# EAGLE design CAN-BUS Shield  v1.2 (EAGLE 6.0)
DESCRIPTION: microOBD 200 OBD-II Module; HW_REV: 1.4; PCB_REV: C; PCB_SPEC1: Layer Count: 4; PCB_SPEC2: Size: 1.3" x 0.59"; PCB_SPEC3: Finish Thickness: 0.049" - 0.052"; PCB_SPEC4: Copper Weight: 1oz; TITLE: STM1120
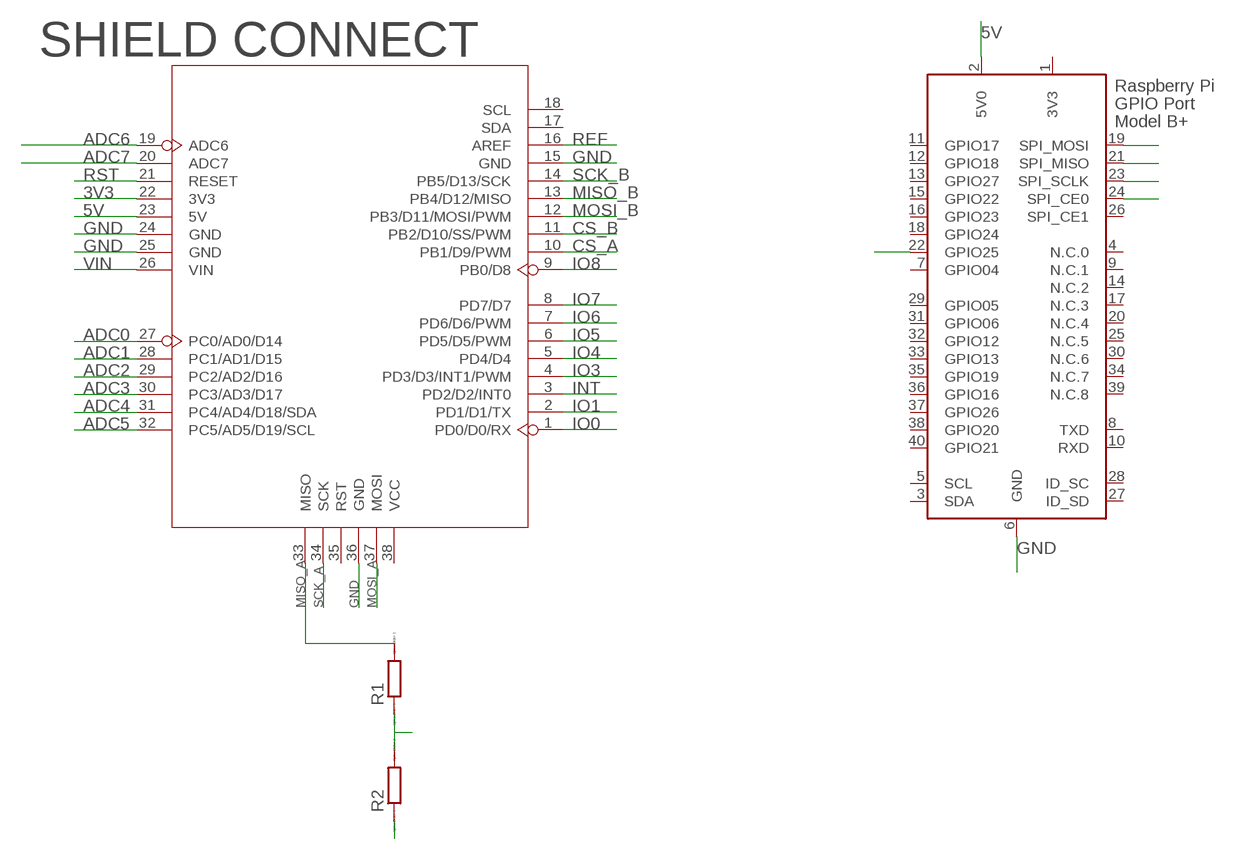
[diagram p0: schematic, sheet 1]

## Parts
R1  R0207/10  [0207/10]
R2  R0207/10  [0207/10]
U3  ARDUINO-38P'WITH/-SILK'  [ARDUINO-38P-WITH/-SILK-500519002]
X2  RASPI_BOARD_B+_E0  [RASPI_BOARD_B+_EDGES_0DRILL]

## Nets
3V3: U3.22(3V3)
5V: U3.23(5V) X2.2(5V0)
ADC0: U3.27(PC0/AD0/D14)
ADC1: U3.28(PC1/AD1/D15)
ADC2: U3.29(PC2/AD2/D16)
ADC3: U3.30(PC3/AD3/D17)
ADC4: U3.31(PC4/AD4/D18/SDA)
ADC5: U3.32(PC5/AD5/D19/SCL)
ADC6: U3.19(ADC6)
ADC7: U3.20(ADC7)
CS_A: U3.10(PB1/D9/PWM)
CS_B: U3.11(PB2/D10/SS/PWM) X2.24(SPI_CE0)
GND: R2.1 U3.15(GND) U3.24(GND) U3.25(GND) U3.36(GND) X2.6(GND)
INT: U3.3(PD2/D2/INT0) X2.22(GPIO25)
IO0: U3.1(PD0/D0/RX)
IO1: U3.2(PD1/D1/TX)
IO3: U3.4(PD3/D3/INT1/PWM)
IO4: U3.5(PD4/D4)
IO5: U3.6(PD5/D5/PWM)
IO6: U3.7(PD6/D6/PWM)
IO7: U3.8(PD7/D7)
IO8: U3.9(PB0/D8)
MISO_A: R1.2 U3.33(MISO)
MISO_B: U3.13(PB4/D12/MISO)
MISO_SCLD: R1.1 R2.2 X2.21(SPI_MISO)
MOSI_A: U3.37(MOSI) X2.19(SPI_MOSI)
MOSI_B: U3.12(PB3/D11/MOSI/PWM)
REF: U3.16(AREF)
RST: U3.21(RESET)
SCK_A: U3.34(SCK) X2.23(SPI_SCLK)
SCK_B: U3.14(PB5/D13/SCK)
VIN: U3.26(VIN)
Unconnected: U3.17(SDA) U3.18(SCL) U3.35(RST) U3.38(VCC) X2.3(SDA) X2.4(N.C.0) X2.5(SCL) X2.7(GPIO04) X2.8(TXD) X2.9(N.C.1) X2.10(RXD) X2.11(GPIO17) X2.12(GPIO18) X2.13(GPIO27) X2.14(N.C.2) X2.15(GPIO22) X2.16(GPIO23) X2.17(N.C.3) X2.18(GPIO24) X2.20(N.C.4) X2.25(N.C.5) X2.26(SPI_CE1) X2.27(ID_SD) X2.28(ID_SC) X2.29(GPIO05) X2.30(N.C.6) X2.31(GPIO06) X2.32(GPIO12) X2.33(GPIO13) X2.34(N.C.7) X2.35(GPIO19) X2.36(GPIO16) X2.37(GPIO26) X2.38(GPIO20) X2.39(N.C.8) X2.40(GPIO21)

## Notes on the sheet
- SHIELD CONNECT

## Power pins joined to a net without a drawn wire
3V3: X2.1(3V3)

## Library data of the parts
R1 R2 = eagle-ltspice:R: RESISTOR, European symbol; SPICEMODEL: NONE; SPICEPREFIX: R
U3 = moudle:ARDUINO-38P
X2 = raspberrypi_bastelstube_v13:RASPI_BOARD_B+: Raspberry Pi GPIO connector with markings for the outer dimensions of the Raspberry Pi board model B+ with different sets of drill holes or mounting pads

## Net classes
0 default: width 0.152 mm, drill 0.305 mm, clearance 0.152 mm

## Board
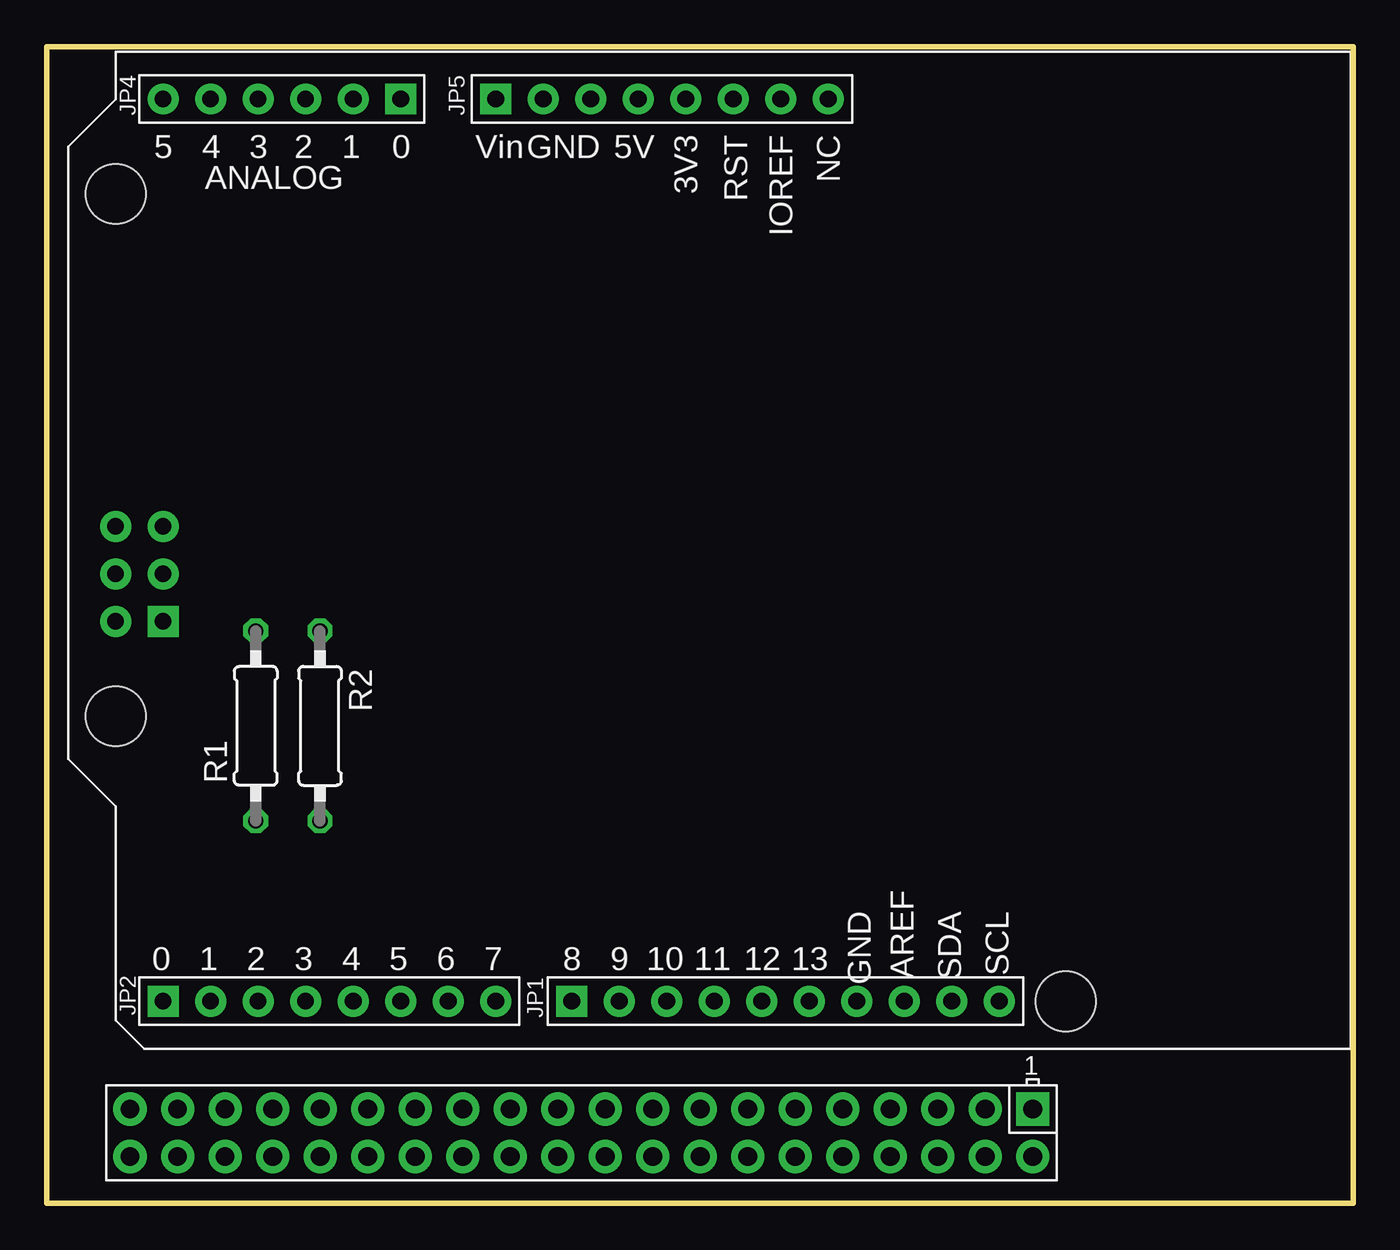
[diagram p1: board, top side]
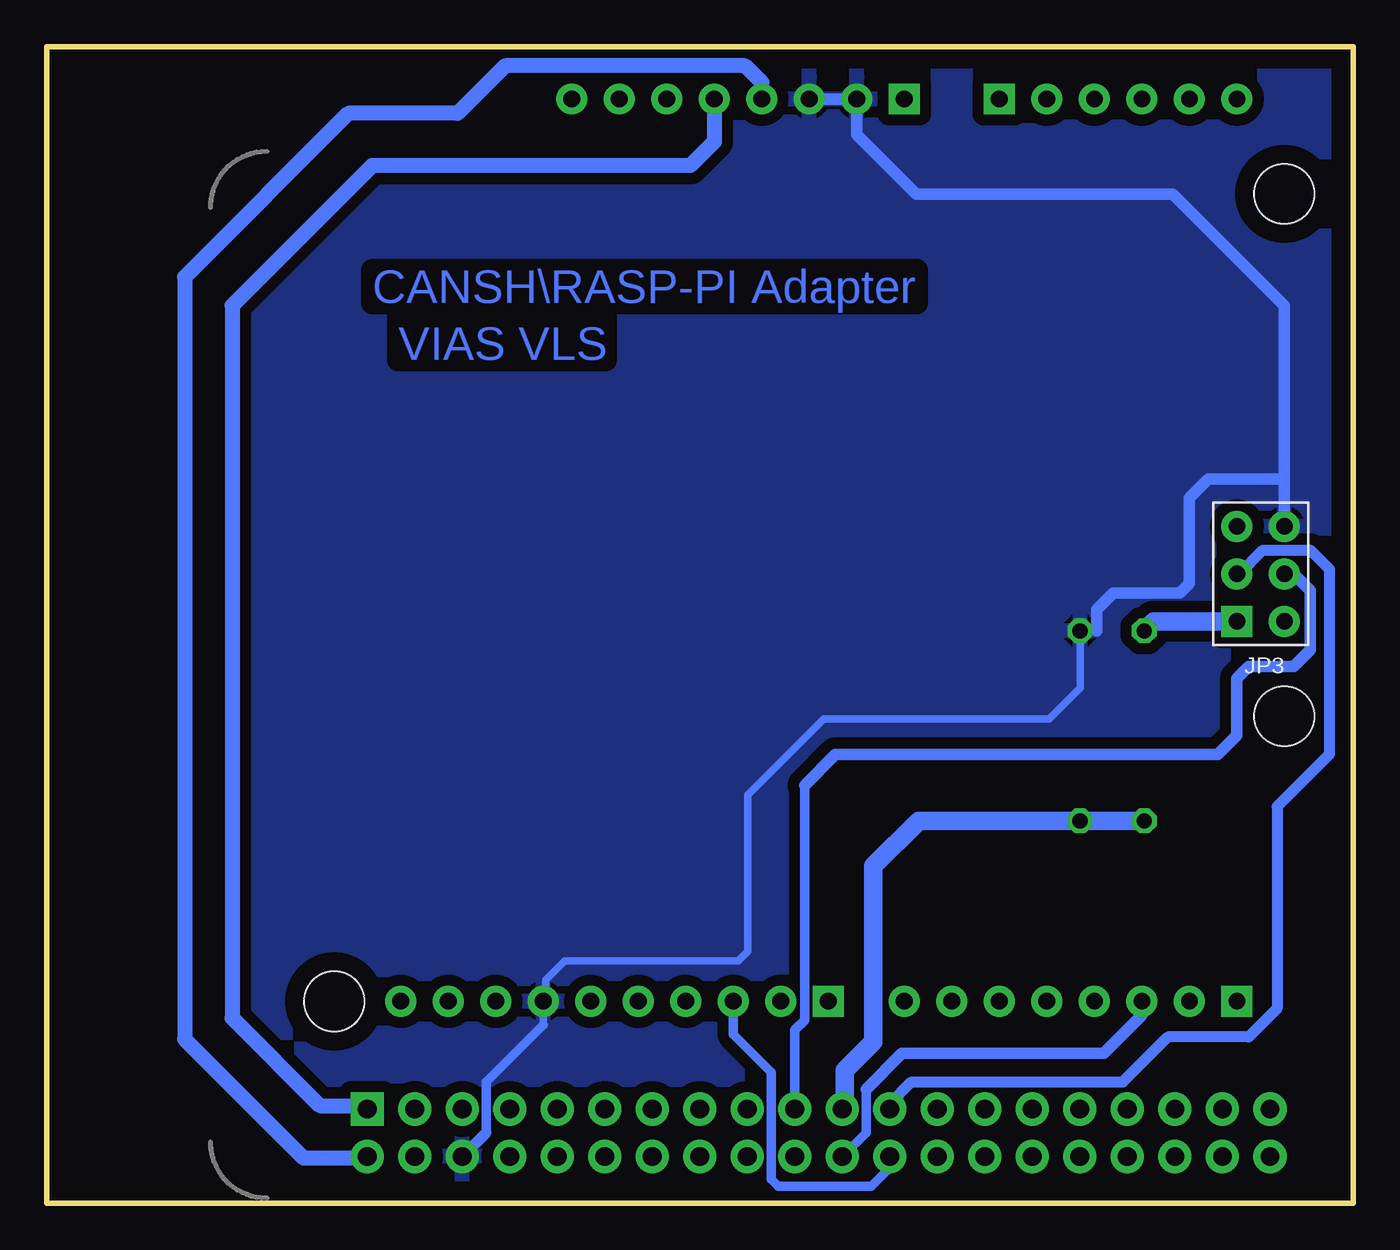
[diagram p2: board, bottom side, seen from below]

Size 69.85 x 61.85 mm. Coordinates in mm from the lower left corner, seen from the top.
Outline: 69.85,61.85 0,61.85 0,0 69.85,0 69.85,61.85
Copper layers (1*16): Top 0.035mm / dielectric 1.5mm / Bottom 0.035mm
Design rules: minimum track width 18mil, minimum drill 24mil, track to track 20mil, track to pad 20mil, pad to pad 8mil, via to via 8mil, smd to smd 8mil, copper to edge 40mil, drill to drill 8mil, minimum pad ring 10mil, minimum via ring 8mil, stop-mask expansion 4mil, vias tented up to drill 0mil, thermal gap 10mil

### Footprints (pad centres in the part's own frame; a part is rotated, then mirrored left to right if it is on the bottom)
0207/10 = drill 0.813 octagon: 1 -5.08,0; 2 5.08,0
ARDUINO-38P-WITH/-SILK-500519002 = drill 0.889 pad 1.651 square: 1 63.5,50.8; 9 41.656,50.8; 26 45.72,2.54; 27 50.8,2.54; 33 63.5,30.48 | drill 0.889 pad 1.651: 2 60.96,50.8; 3 58.42,50.8; 4 55.88,50.8; 5 53.34,50.8; 6 50.8,50.8; 7 48.26,50.8; 8 45.72,50.8; 10 39.116,50.8; 11 36.576,50.8; 12 34.036,50.8; 13 31.496,50.8; 14 28.956,50.8; 15 26.416,50.8; 16 23.876,50.8; 17 21.336,50.8; 18 18.796,50.8; 19 27.94,2.54; 20 30.48,2.54; 21 33.02,2.54; 22 35.56,2.54; 23 38.1,2.54; 24 40.64,2.54; 25 43.18,2.54; 28 53.34,2.54; 29 55.88,2.54; 30 58.42,2.54; 31 60.96,2.54; 32 63.5,2.54; 34 63.5,27.94; 35 63.5,25.4; 36 66.04,25.4; 37 66.04,27.94; 38 66.04,30.48 | hole 3.2: 15.24,50.8; 66.04,35.56; 66.04,7.62
RASPI_BOARD_B+_EDGES_0DRILL = drill 1 pad 1.778 square: 1 8.37,51.23 | drill 1 pad 1.778: 2 8.37,53.77; 3 10.91,51.23; 4 10.91,53.77; 5 13.45,51.23; 6 13.45,53.77; 7 15.99,51.23; 8 15.99,53.77; 9 18.53,51.23; 10 18.53,53.77; 11 21.07,51.23; 12 21.07,53.77; 13 23.61,51.23; 14 23.61,53.77; 15 26.15,51.23; 16 26.15,53.77; 17 28.69,51.23; 18 28.69,53.77; 19 31.23,51.23; 20 31.23,53.77; 21 33.77,51.23; 22 33.77,53.77; 23 36.31,51.23; 24 36.31,53.77; 25 38.85,51.23; 26 38.85,53.77; 27 41.39,51.23; 28 41.39,53.77; 29 43.93,51.23; 30 43.93,53.77; 31 46.47,51.23; 32 46.47,53.77; 33 49.01,51.23; 34 49.01,53.77; 35 51.55,51.23; 36 51.55,53.77; 37 54.09,51.23; 38 54.09,53.77; 39 56.63,51.23; 40 56.63,53.77

### Placement (x,y rotation side)
R1  11.18,25.53 90 top
R2  14.61,25.53 270 top
U3  69.72,61.59 180 top
X2  61.09,56.26 180 top

### Tracks (layer width: path | path; a pad name or v marks a point on that pad's centre or on a via)
3V3
  Bottom 0.813: U3.22 34.16,56.77 35.43,55.5 52.45,55.5 59.94,48.01 59.94,9.91 55.24,5.21 52.89,5.21 X2.1
5V
  Bottom 0.813: U3.23 31.62,59.94 32.51,60.83 45.34,60.83 47.88,58.29 53.72,58.29 62.48,49.53 62.48,8.76 56.13,2.41 52.8,2.41 X2.2
CS_B
  Bottom 0.5: U3.11 33.15,9.02 31.11,6.99 31.11,1.27 30.73,0.89 25.78,0.89 24.78,1.89 X2.24
GND
  Bottom 0.406: 43.31,9.53 U3.15 43.18,10.92 43.18,11.94 42.16,12.95 32.89,12.95 32.38,13.46 32.38,21.84 28.32,25.91 16.26,25.91 14.61,27.56 R2.1
  Bottom 0.5: 43.31,9.53 46.35,6.48 46.35,3.77
  Bottom 0.6: 46.35,3.77 X2.6
  Bottom 0.61: U3.36 3.68,38.73 | 3.68,38.73 3.68,48.01 9.65,53.97 23.37,53.97 26.54,57.15 U3.25 U3.24 | 13.72,30.61 13.72,31.75 12.83,32.64 9.27,32.64 8.76,33.15 8.76,37.72 7.75,38.73 3.68,38.73
  pour Bottom (isolate 0.6): 69.6,61.85 -0.13,61.85 -0.13,0.13 69.6,0.13
INT
  Bottom 0.5: X2.22 26.04,3.77 26.04,6.1
  Bottom 0.61: U3.3 11.3,10.03 13.33,8 24.13,8 26.04,6.1
MISO_A
  Bottom 1: U3.33 10.67,31.11 R1.2
MISO_SCLD
  Bottom 0.406: R2.2 14.86,20.45
  Bottom 0.61: 27.18,5.17 X2.21
  Bottom 1: 27.18,5.17 27.18,7.11 25.65,8.64 25.65,18.03 23.24,20.45 R2.2 R1.1
MOSI_A
  Bottom 0.406: 29.34,22.48 29.34,22.35
  Bottom 0.5: X2.19 29.86,9.26 29.34,9.78 29.34,22.35
  Bottom 0.61: U3.37 3.17,33.66 2.29,32.77 2.29,29.59 3.17,28.7 5.59,28.7 6.22,28.07 6.22,25.02 7.24,24 27.69,24 29.34,22.35
SCK_A
  Bottom 0.5: U3.34 6.1,33.66
  Bottom 0.6: X2.23 24.78,5.32 23.62,6.48 12.32,6.48 9.91,8.89 5.59,8.89 4.06,10.41 4.06,21.21 1.27,24 1.27,33.91 2.29,34.92 4.83,34.92 6.1,33.66

### Text on the board
Bottom: CANSH\RASP-PI Adapter | VIAS VLS